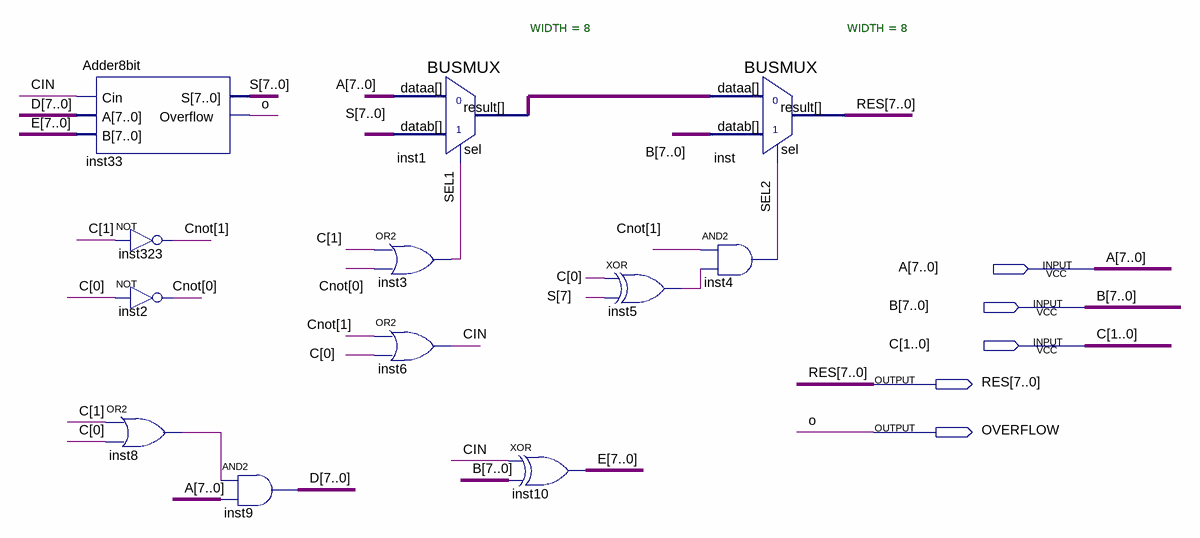
[diagram p0: schematic sheet]
// Quartus schematic ABS_MIN_ADD_SUB.bdf as structural Verilog: 12 symbols, 5 pins
module ABS_MIN_ADD_SUB (
  input  [7:0] A,
  input  [7:0] B,
  input  [1:0] C,
  output [7:0] RES,
  output OVERFLOW
);

  wire CIN, inst5_out, inst8_out, SEL1, SEL2;
  wire [1:0] Cnot;
  wire [7:0] D, E, inst1_result, S;

  Adder8bit inst33 (.Cin(CIN), .A(D), .B(E), .S(S), .Overflow(OVERFLOW));
  not inst323 (Cnot[1], C[1]);
  not inst2 (Cnot[0], C[0]);
  or inst8 (inst8_out, C[1], C[0]);
  assign D = {8{inst8_out}} & A;  // AND2 inst9, 8 bits wide
  or inst3 (SEL1, C[1], Cnot[0]);
  or inst6 (CIN, Cnot[1], C[0]);
  BUSMUX #(.WIDTH(8)) inst1 (.datab(S), .sel(SEL1), .dataa(A), .result(inst1_result));
  assign E = {8{CIN}} ^ B;  // XOR inst10, 8 bits wide
  xor inst5 (inst5_out, C[0], S[7]);
  BUSMUX #(.WIDTH(8)) inst (.datab(B), .sel(SEL2), .dataa(inst1_result), .result(RES));
  and inst4 (SEL2, Cnot[1], inst5_out);

  // Other names for the same wires on the sheet: o = OVERFLOW
endmodule
